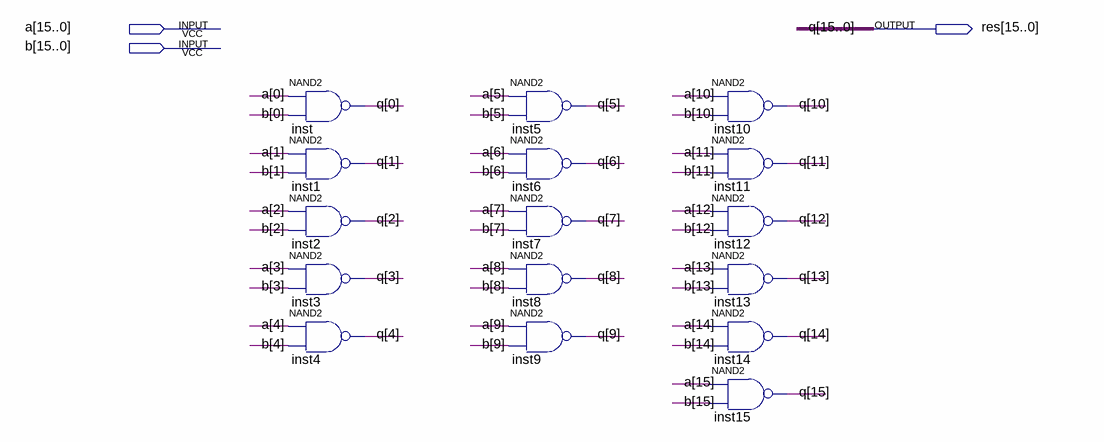
[diagram p0: schematic sheet]
// Quartus schematic mynand.bdf as structural Verilog: 16 symbols, 3 pins
module mynand (
  input  [15:0] a,
  input  [15:0] b,
  output [15:0] res
);

  nand inst (res[0], a[0], b[0]);
  nand inst1 (res[1], a[1], b[1]);
  nand inst2 (res[2], a[2], b[2]);
  nand inst3 (res[3], a[3], b[3]);
  nand inst4 (res[4], a[4], b[4]);
  nand inst5 (res[5], a[5], b[5]);
  nand inst6 (res[6], a[6], b[6]);
  nand inst7 (res[7], a[7], b[7]);
  nand inst8 (res[8], a[8], b[8]);
  nand inst9 (res[9], a[9], b[9]);
  nand inst10 (res[10], a[10], b[10]);
  nand inst11 (res[11], a[11], b[11]);
  nand inst12 (res[12], a[12], b[12]);
  nand inst13 (res[13], a[13], b[13]);
  nand inst14 (res[14], a[14], b[14]);
  nand inst15 (res[15], a[15], b[15]);

  // Other names for the same wires on the sheet: q[15:0] = res
endmodule
